# EAGLE design breezeduino (EAGLE 7.6.0)
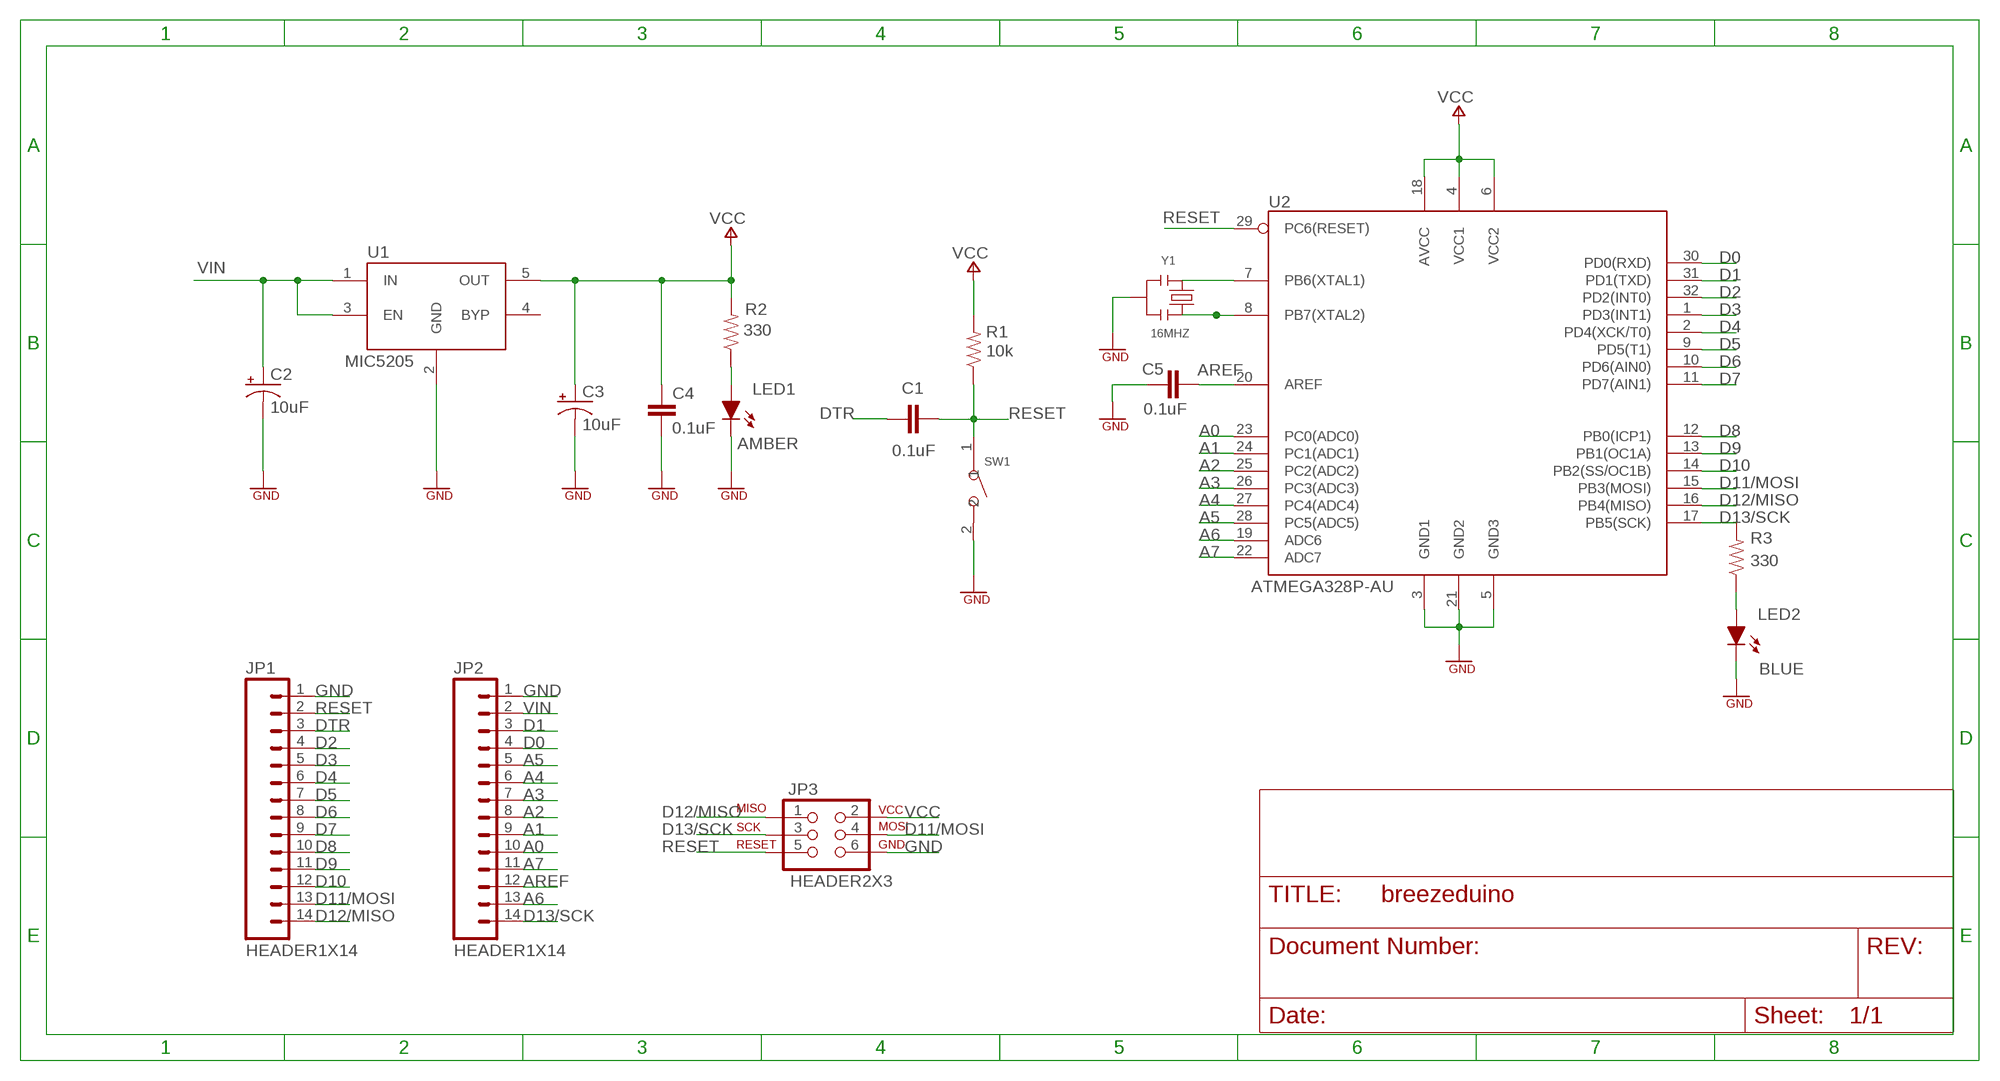
[diagram p0: schematic, sheet 1]

## Parts
C1  0.1uF  CAP_0603  [SMD0603]
C2  10uF  CAP_TANT  [EIA3216]
C3  10uF  CAP_TANT  [EIA3216]
C4  0.1uF  CAP_0603  [SMD0603]
C5  0.1uF  CAP_0603  [SMD0603]
JP1  HEADER1X14  [1X14]
JP2  HEADER1X14  [1X14]
JP3  HEADER2X3  [2X3]
LED1  AMBER  LED_0603  [LED_0603]
LED2  BLUE  LED_0805  [LED_0805]
R1  10k  RES_0603  [SMD0603]
R2  330  RES_0603  [SMD0603]
R3  330  RES_0603  [SMD0603]
SW1  SMD-BUTTON(2P-3.0X2.5X1.2+0.4MM)-B3U-1000P-2P-SMD  [SW2-2.6-3.0X2.5X1.2+0.4MM]
U1  MIC5205  [SOT23-5]
U2  ATMEGA328P-AU  [TQFP32]
Y1  16MHZ  SMD-RESONATOR-16MHZ-15PF-0.5%-40R(3P-3.2X1.3MM)  [X3-SMD-3.6X1.3X0.8MM]

## Nets
A0: JP2.10 U2.23(PC0(ADC0))
A1: JP2.9 U2.24(PC1(ADC1))
A2: JP2.8 U2.25(PC2(ADC2))
A3: JP2.7 U2.26(PC3(ADC3))
A4: JP2.6 U2.27(PC4(ADC4))
A5: JP2.5 U2.28(PC5(ADC5))
A6: JP2.13 U2.19(ADC6)
A7: JP2.11 U2.22(ADC7)
AREF: C5.1 JP2.12 U2.20(AREF)
D0: JP2.4 U2.30(PD0(RXD))
D1: JP2.3 U2.31(PD1(TXD))
D2: JP1.4 U2.32(PD2(INT0))
D3: JP1.5 U2.1(PD3(INT1))
D4: JP1.6 U2.2(PD4(XCK/T0))
D5: JP1.7 U2.9(PD5(T1))
D6: JP1.8 U2.10(PD6(AIN0))
D7: JP1.9 U2.11(PD7(AIN1))
D8: JP1.10 U2.12(PB0(ICP1))
D9: JP1.11 U2.13(PB1(OC1A))
D10: JP1.12 U2.14(PB2(SS/OC1B))
D11/MOSI: JP1.13 JP3.4 U2.15(PB3(MOSI))
D12/MISO: JP1.14 JP3.1 U2.16(PB4(MISO))
D13/SCK: JP2.14 JP3.3 R3.2 U2.17(PB5(SCK))
DTR: C1.1 JP1.3
GND [GND]: C2.C(-) C3.C(-) C4.2 C5.2 JP1.1 JP2.1 JP3.6 LED1.C LED2.C SW1.2 U1.2(GND) U2.3(GND1) U2.5(GND3) U2.21(GND2) Y1.2
N$1: U2.7(PB6(XTAL1)) Y1.1
N$2: U2.8(PB7(XTAL2)) Y1.3
N$3: LED1.A R2.1
N$5: LED2.A R3.1
RESET: C1.2 JP1.2 JP3.5 R1.1 SW1.1 U2.29(PC6(RESET))
VCC: C3.A(+) C4.1 JP3.2 R1.2 R2.2 U1.5(OUT) U2.4(VCC1) U2.6(VCC2) U2.18(AVCC)
VIN: C2.A(+) JP2.2 U1.1(IN) U1.3(EN)
Unconnected: U1.4(BYP)

## Library data of the parts
C1 C4 C5 = eagle-book:CAP: Non-polarized capacitor
C2 C3 = eagle-book:CAP_TANT: Polarized capacitor (Tantalum)
JP1 JP2 = eagle-book:HEADER1X14: 14-pin header with pins spaced 0.1" apart
JP3 = eagle-book:HEADER2X3: 6-pin header with pins spaced 0.1" apart (HEADD6)
LED1 LED2 = eagle-book:LED: Light Emitting Diode
R1-R3 = eagle-book:RES: Resistor
SW1 = Seeed-Switch:SMD-BUTTON(2P-3.0X2.5X1.2+0.4MM): 311020047; MPN: B3U-1000P-2P-SMD; VALUE: B3U-1000P-2P-SMD
U1 = eagle-book:MIC5205: 5-volt voltage regulator (UA78M05)
U2 = eagle-book:ATMEGA328P: Atmel 32-pin 8-bit microcontroller
Y1 = Seeed-Crystal Oscillator:SMD-RESONATOR-16MHZ-15PF-0.5%-40R(3P-3.2X1.3MM): 306030002; MPN: CSTCE16M0V53-R0

## Net classes
0 default: width 0.203 mm
1 VCC: width 0.305 mm, drill 0.406 mm
2 VIN: width 0.305 mm, drill 0.406 mm
3 AREF: width 0.254 mm, drill 0.406 mm
4 GND: width 0.254 mm, drill 0.406 mm

## Board
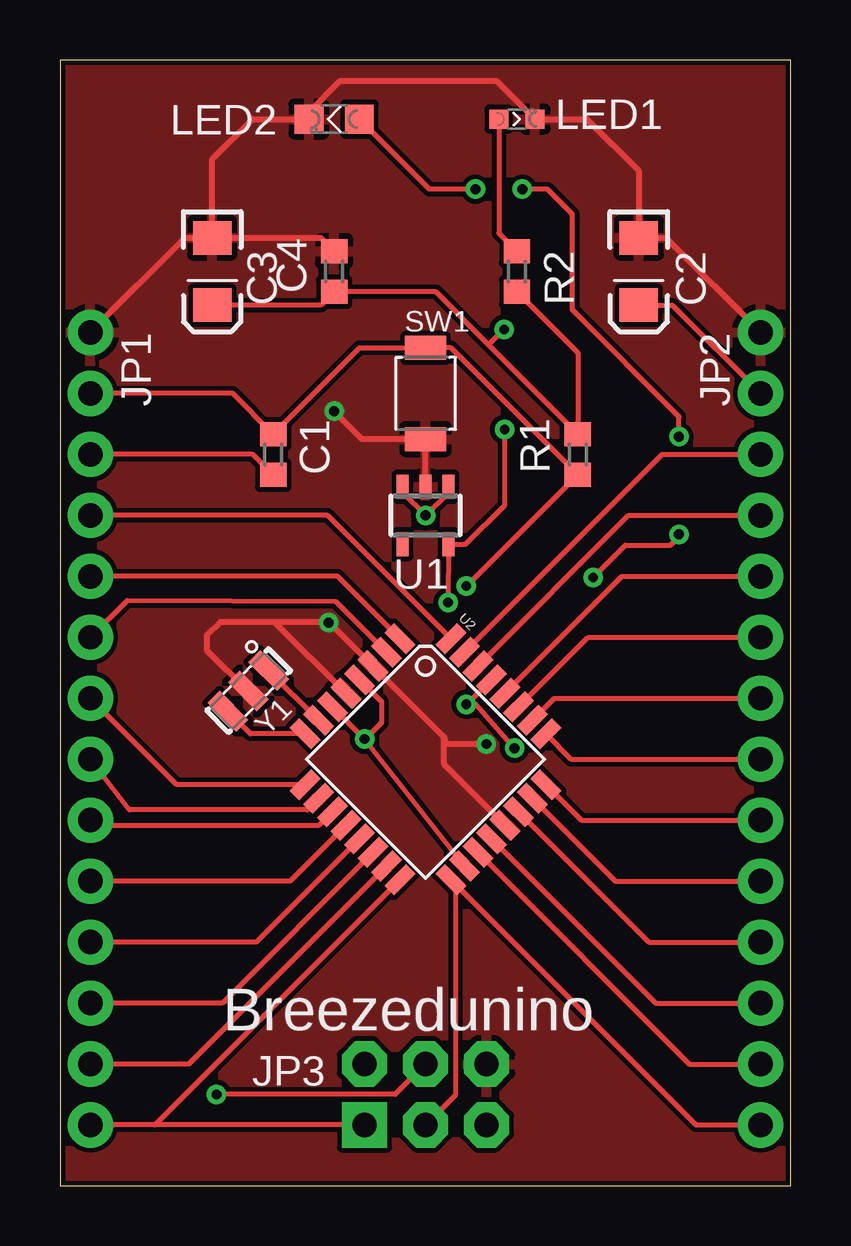
[diagram p1: board, top side]
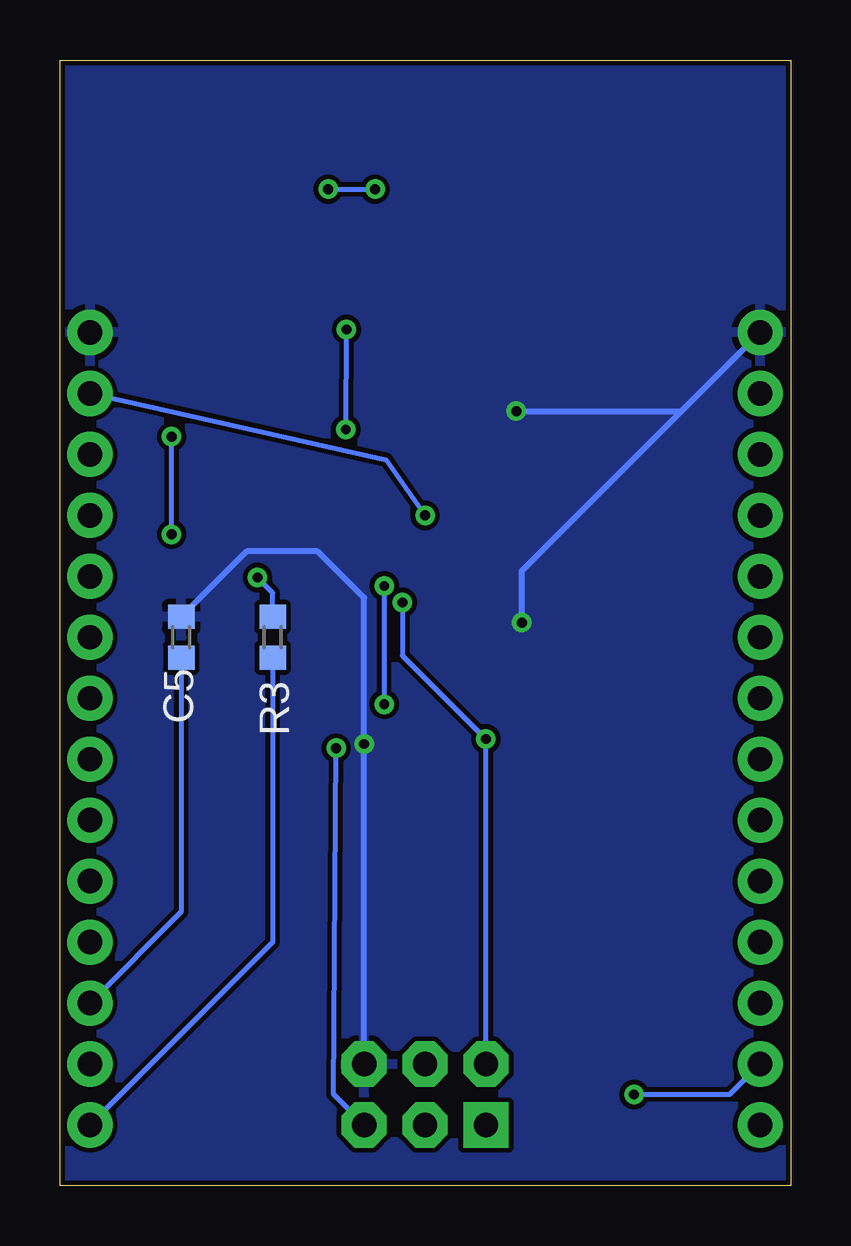
[diagram p2: board, bottom side, seen from below]

Size 30.46 x 46.91 mm. Coordinates in mm from the lower left corner, seen from the top.
Outline: 0,0 30.46,0 30.46,46.91 0,46.91 0,0
Copper layers (1*16): Top 0.035mm / dielectric 1.5mm / Bottom 0.035mm
Design rules "femtoduino": minimum track width 8mil, minimum drill 16mil, track to track 8mil, track to pad 8mil, pad to pad 8mil, via to via 8mil, smd to smd 8mil, copper to edge 8mil, drill to drill 8mil, minimum pad ring 10mil, minimum via ring 8mil, stop-mask expansion 4mil, vias tented up to drill 0mil, thermal gap 10mil

### Footprints (pad centres in the part's own frame; a part is rotated, then mirrored left to right if it is on the bottom)
SMD0603 = smd 1 x 1.1: 1 -0.85,0; 2 0.85,0
EIA3216 = smd 1.4 x 1.6: A 1.4,0; C -1.4,0
1X14 = drill 1.016 pad 1.88: 1 0,0; 2 2.54,0; 3 5.08,0; 4 7.62,0; 5 10.16,0; 6 12.7,0; 7 15.24,0; 8 17.78,0; 9 20.32,0; 10 22.86,0; 11 25.4,0; 12 27.94,0; 13 30.48,0; 14 33.02,0
2X3 = drill 1.016 pad 1.88 square: 1 -2.54,-1.27 | drill 1.016 pad 1.88 octagon: 2 -2.54,1.27; 3 0,-1.27; 4 0,1.27; 5 2.54,-1.27; 6 2.54,1.27
LED_0603 = smd 0.8 x 0.8: A 0,-0.75; C 0,0.75
LED_0805 = smd 1.2 x 1.2: A 0,-1.05; C 0,1.05
SW2-2.6-3.0X2.5X1.2+0.4MM = smd 1 x 1.7: 1 -1.9,0; 2 1.9,0
SOT23-5 = smd 0.5 x 1: 1 -0.95,-1.2; 2 0,-1.2; 3 0.95,-1.2; 4 0.95,1.2; 5 -0.95,1.2
TQFP32 = smd 1.27 x 0.559: 1 -4.293,2.8; 2 -4.293,2; 3 -4.293,1.2; 4 -4.293,0.4; 5 -4.293,-0.4; 6 -4.293,-1.2; 7 -4.293,-2; 8 -4.293,-2.8; 17 4.293,-2.8; 18 4.293,-2; 19 4.293,-1.2; 20 4.293,-0.4; 21 4.293,0.4; 22 4.293,1.2; 23 4.293,2; 24 4.293,2.8 | smd 0.559 x 1.27: 9 -2.8,-4.293; 10 -2,-4.293; 11 -1.2,-4.293; 12 -0.4,-4.293; 13 0.4,-4.293; 14 1.2,-4.293; 15 2,-4.293; 16 2.8,-4.293; 25 2.8,4.293; 26 2,4.293; 27 1.2,4.293; 28 0.4,4.293; 29 -0.4,4.293; 30 -1.2,4.293; 31 -2,4.293; 32 -2.8,4.293
X3-SMD-3.6X1.3X0.8MM = smd 0.7 x 1.7: 1 -1.2,0; 2 0,0; 3 1.2,0

### Placement (x,y rotation side)
C1  8.89,30.48 90 top
C2  24.13,38.1 270 top
C3  6.35,38.1 270 top
C4  11.43,38.1 90 top
C5  25.4,22.86 90 bottom
JP1  1.27,35.56 270 top
JP2  29.21,35.56 270 top
JP3  15.24,3.81 0 top
LED1  19.05,44.45 270 top
LED2  11.43,44.45 90 top
R1  21.59,30.48 90 top
R2  19.05,38.1 270 top
R3  21.59,22.86 270 bottom
SW1  15.24,33.02 270 top
U1  15.24,27.94 180 top
U2  15.24,17.78 315 top
Y1  7.85,20.62 225 top

### Tracks (layer width: path | path; a pad name or v marks a point on that pad's centre or on a via)
A0
  Top 0.203: U2.23 23.15,12.7 JP2.10
A1
  Top 0.203: U2.24 21.74,15.24 JP2.9
A2
  Top 0.203: U2.25 21.31,17.78 JP2.8
A3
  Top 0.203: U2.26 20.61,20.32 JP2.7
A4
  Top 0.203: U2.27 22.02,22.86 JP2.6
A5
  Top 0.203: U2.28 23.43,25.4 JP2.5
A6
  Top 0.203: U2.19 26.24,5.08 JP2.13
A7
  Top 0.203: U2.22 24.56,10.16 JP2.11
AREF
  Top 0.203: U2.20 24.83,7.62 JP2.12
  Bottom 0.203: C5.1 25.4,11.43 JP2.12
D0
  Top 0.203: U2.30 23.7,27.94 JP2.4
D1
  Top 0.203: U2.31 25.11,30.48 JP2.3
D2
  Top 0.203: U2.32 11.15,27.94 JP1.4
D3
  Top 0.203: U2.1 11.58,25.4 JP1.5
D4
  Top 0.203: U2.2 11.52,24.33 2.79,24.38 JP1.6
D5
  Top 0.203: U2.9 4.87,16.73 JP1.7
D6
  Top 0.203: U2.10 10.3,15.67 2.9,15.67 JP1.8
D7
  Top 0.203: U2.11 10.77,15.01 1.5,15.01 JP1.9
D8
  Top 0.203: U2.12 9.59,12.7 JP1.10
D9
  Top 0.203: U2.13 8.19,10.16 JP1.11
D10
  Top 0.203: U2.14 6.78,7.62 JP1.12
D11/MOSI  (via drill 0.41)
  Top 0.203: U2.15 5.37,5.08 JP1.13 | JP3.4 13.97,3.81 v6.53,3.81
  Bottom 0.203: v6.53,3.81 2.54,3.81 JP1.13
D12/MISO
  Top 0.203: U2.16 3.96,2.54 | 3.96,2.54 JP1.14 | JP3.1 3.96,2.54
D13/SCK
  Top 0.203: JP2.14 26.52,2.54 U2.17 arc-90 16.48,12.58 16.48,3.79 JP3.3
  Bottom 0.203: R3.2 21.59,10.16 JP2.14
DTR
  Top 0.203: C1.1 8.04,30.48 JP1.3
GND  (via drill 0.41)
  Top 0.254: 11.22,23.5 U2.3 16.01,18.7 | 11.22,23.5 8.94,23.5 | 8.94,23.5 6.68,23.5 6.12,22.94 6.12,22.33 7.82,20.62 Y1.2 | U2.5 8.94,23.5 | JP1.1 5.21,39.5 C3.C | C3.C 6.35,42.77 8.03,44.45 LED2.C 10.38,44.75 11.66,46.02 18.23,46.02 LED1.C 21.97,44.45 24.13,42.29 C2.C 25.27,39.5 JP2.1 | C3.C 10.88,39.5 C4.2 | U1.2 SW1.2 12.59,31.12 v11.43,32.28 | 16.01,18.7 16.1,18.41 v17.78,18.41 | U2.21 16.01,17.57 16.01,18.7 | 11.22,23.5 11.22,23.49 v11.2,23.47
  Bottom 0.254: JP3.6 v17.78,18.41 17.78,24.51 19.71,26.44 22.67,26.44 C5.2 | v11.43,32.28 4.55,32.28 | 4.55,32.28 JP1.1 | v11.2,23.47 11.2,25.63 4.55,32.28
  pour Top: 0.25,0.25 0.25,46.74 30.23,46.74 30.23,0.25
  pour Bottom: 0.25,0.25 0.25,46.74 30.23,46.74 30.23,0.25
N$1
  Top 0.203: U2.7 Y1.1
N$2
  Top 0.203: U2.8 7.94,18.84 Y1.3
N$3
  Top 0.203: LED1.A 18.3,39.7 R2.1
N$5  (via drill 0.41)
  Top 0.203: v22.23,25.35 23.57,26.7 25.45,26.7 25.81,27.05 v25.81,27.15 | v25.81,31.22 25.81,32.05 21.36,36.5 21.36,40.49 20.32,41.53 v19.28,41.53 | v17.32,41.53 15.4,41.53 LED2.A
  Bottom 0.203: R3.1 21.59,24.71 v22.23,25.35 | v25.81,27.15 v25.81,31.22 | v19.28,41.53 v17.32,41.53
RESET  (via drill 0.41)
  Top 0.203: JP1.2 7.2,33.02 C1.2 12.48,34.92 SW1.1 16.3,34.92 R1.1 v16.94,24.99 | U2.29 16.96,20.07 v16.94,20.07 17.35,20.07 v18.95,18.24
  Bottom 0.203: v16.94,24.99 v16.94,20.07 | JP3.5 19.05,3.81 v18.95,18.24
VCC  (via drill 0.41)
  Top 0.203: R2.2 21.59,34.71 R1.2 17.88,35.05 | C3.A 10.88,36.7 C4.1 15.67,37.25 17.88,35.05 | v12.7,18.62 U2.6 | U2.18 v12.7,18.62 | U2.4 13.41,20.17 13.41,19.3 12.72,18.62 v12.7,18.62 | v16.18,24.31 U1.5 16.91,26.74 18.54,28.37 v18.54,31.52 | v18.52,35.69 17.88,35.05
  Bottom 0.203: JP3.2 v12.7,18.62 16.18,22.1 v16.18,24.31 | v18.54,31.52 v18.52,35.69
VIN  (via drill 0.41)
  Top 0.203: C2.A 25.53,36.7 JP2.2 | U1.3 14.29,28.89 v15.24,27.94 16.19,28.89 U1.1
  Bottom 0.203: JP2.2 16.87,30.25 v15.24,27.94

### Text on the board
tNames: Breezedunino